# EAGLE design Minimum-System (EAGLE 6.0)
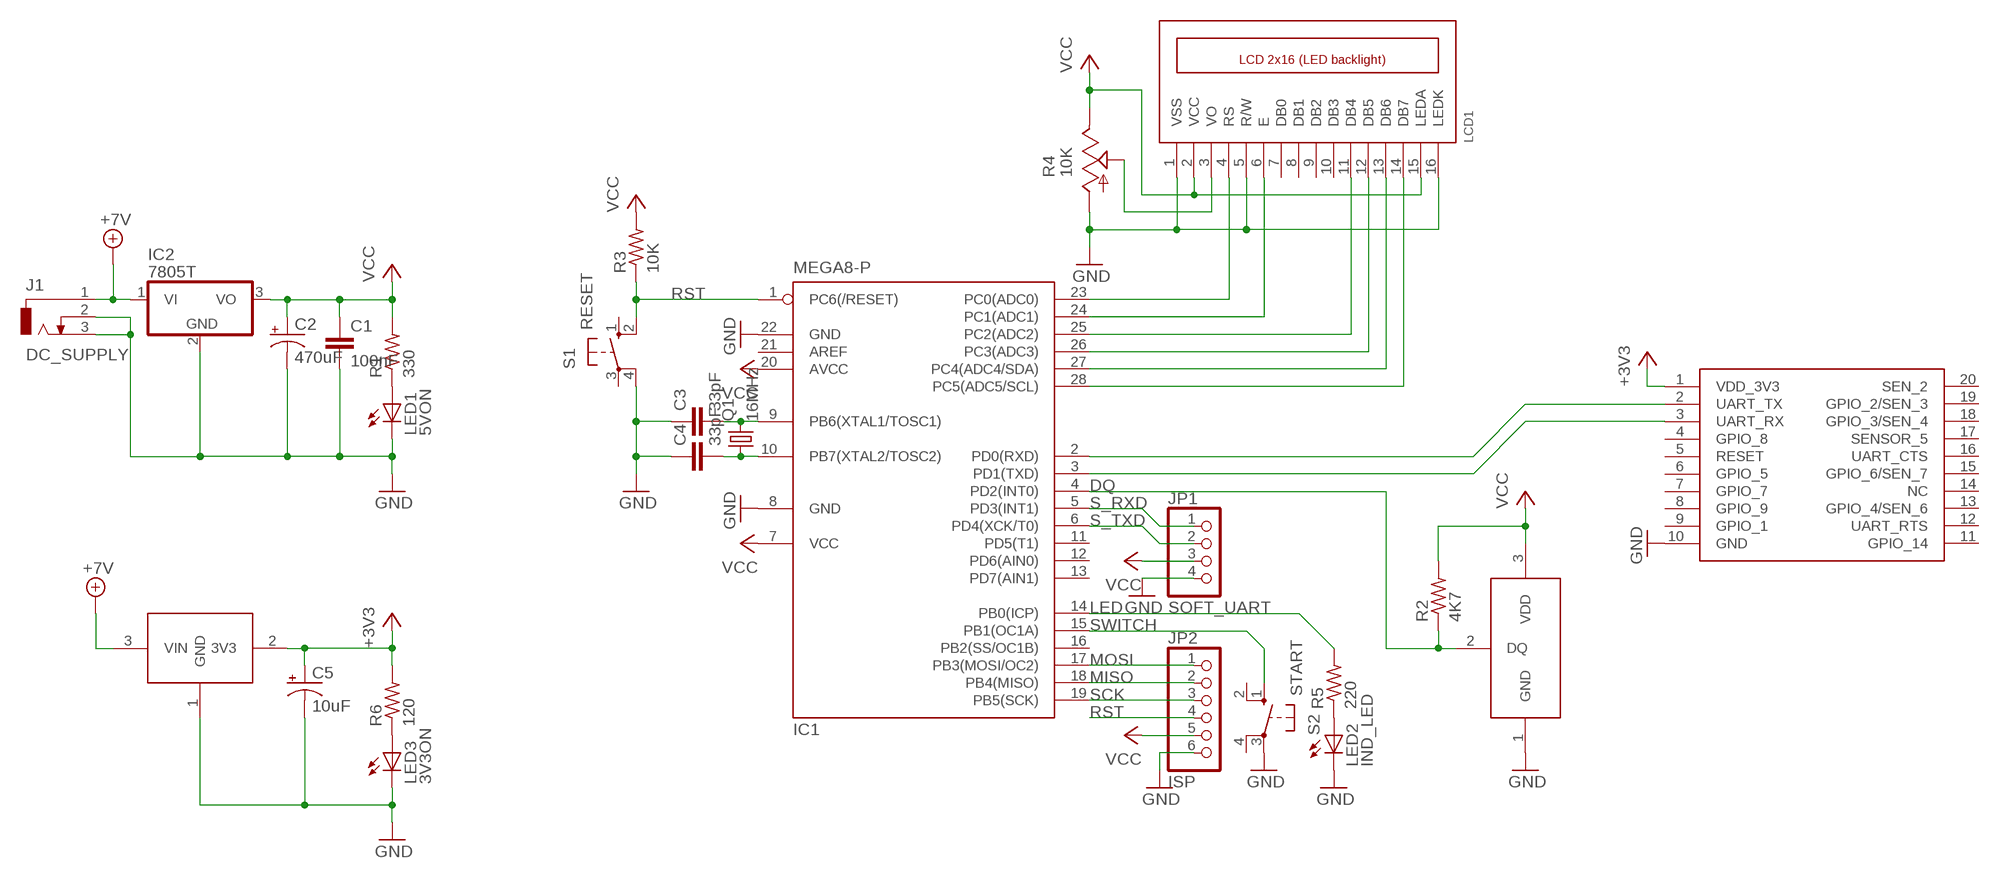
[diagram p0: schematic, sheet 1]

## Parts
C1  100nF  C-EU025-024X044  [C025-024X044]
C2  470uF  CPOL-USE2.5-7  [E2,5-7]
C3  33pF  C-EU025-024X044  [C025-024X044]
C4  33pF  C-EU025-024X044  [C025-024X044]
C5  10uF  CPOL-USE2.5-7  [E2,5-7]
IC1  MEGA8-P  [DIL28-3]
IC2  7805T  [TO220H]
J1  DC_SUPPLY  DCJ0202  [DCJ0202]
JP1  SOFT_UART  PINHD-1X4  [1X04]
JP2  ISP  PINHD-1X6  [1X06]
LCD1  LCD_2X16  LCD_2X16_SIL  [HY-1602F]
LED1  5VON  LED3MM  [LED3MM]
LED2  IND_LED  LED3MM  [LED3MM]
LED3  3V3ON  LED3MM  [LED3MM]
Q1  16MHz  CRYSTALHC49S  [HC49/S]
R1  330  R-US_0207/10  [0207/10]
R2  4K7  R-US_0207/10  [0207/10]
R3  10K  R-US_0207/10  [0207/10]
R4  10K  TRIM_US-CA6V  [CA6V]
R5  220  R-US_0207/10  [0207/10]
R6  120  R-US_0207/10  [0207/10]
S1  RESET  10-XX  [B3F-10XX]
S2  START  10-XX  [B3F-10XX]
U1  DS1820  [TO92]
U2  LD1117V33  [TO220]
U3  WIFLY  [WIFLY_SOCKET]

## Nets
+3V3: C5.+ R6.2 U2.2(3V3) U3.1(VDD_3V3)
+7V: IC2.1(VI) J1.1 U2.3(VIN)
DQ: IC1.4(PD2(INT0)) R2.1 U1.2(DQ)
GND: C1.2 C2.- C3.1 C4.1 C5.- IC1.8(GND) IC1.22(GND) IC2.2(GND) J1.2 J1.3 JP1.4 JP2.6 LCD1.1(VSS) LCD1.5(R/W) LCD1.16(LEDK) LED1.K(C) LED2.K(C) LED3.K(C) R4.A S1.4(P1) S2.3(P) U1.1(GND) U2.1(GND) U3.10(GND)
LED: IC1.14(PB0(ICP)) R5.2
MISO: IC1.18(PB4(MISO)) JP2.2
MOSI: IC1.17(PB3(MOSI/OC2)) JP2.1
N$1: LED1.A R1.1
N$2: IC1.25(PC2(ADC2)) LCD1.11(DB4)
N$3: LCD1.3(VO) R4.S
N$5: IC1.23(PC0(ADC0)) LCD1.4(RS)
N$6: C3.2 IC1.9(PB6(XTAL1/TOSC1)) Q1.2
N$7: C4.2 IC1.10(PB7(XTAL2/TOSC2)) Q1.1
N$8: IC1.24(PC1(ADC1)) LCD1.6(E)
N$9: IC1.26(PC3(ADC3)) LCD1.12(DB5)
N$10: IC1.27(PC4(ADC4/SDA)) LCD1.13(DB6)
N$11: IC1.28(PC5(ADC5/SCL)) LCD1.14(DB7)
N$12: IC1.2(PD0(RXD)) U3.2(UART_TX)
N$13: IC1.3(PD1(TXD)) U3.3(UART_RX)
N$14: LED2.A R5.1
N$16: LED3.A R6.1
RST: IC1.1(PC6(/RESET)) JP2.4 R3.1 S1.2(S1)
S_RXD: IC1.5(PD3(INT1)) JP1.1
S_TXD: IC1.6(PD4(XCK/T0)) JP1.2
SCK: IC1.19(PB5(SCK)) JP2.3
SWITCH: IC1.15(PB1(OC1A)) S2.1(S)
VCC: C1.1 C2.+ IC1.7(VCC) IC1.20(AVCC) IC2.3(VO) JP1.3 JP2.5 LCD1.2(VCC) LCD1.15(LEDA) R1.2 R2.2 R3.2 R4.E U1.3(VDD)
Unconnected: IC1.11(PD5(T1)) IC1.12(PD6(AIN0)) IC1.13(PD7(AIN1)) IC1.16(PB2(SS/OC1B)) IC1.21(AREF) LCD1.7(DB0) LCD1.8(DB1) LCD1.9(DB2) LCD1.10(DB3) S1.1(S) S1.3(P) S2.2(S1) S2.4(P1) U3.4(GPIO_8) U3.5(RESET) U3.6(GPIO_5) U3.7(GPIO_7) U3.8(GPIO_9) U3.9(GPIO_1) U3.11(GPIO_14) U3.12(UART_RTS) U3.13(GPIO_4/SEN_6) U3.14(NC) U3.15(GPIO_6/SEN_7) U3.16(UART_CTS) U3.17(SENSOR_5) U3.18(GPIO_3/SEN_4) U3.19(GPIO_2/SEN_3) U3.20(SEN_2)

## Library data of the parts
C1 C3 C4 = resistor:C-EU: CAPACITOR, European symbol
C2 C5 = resistor:CPOL-US: POLARIZED CAPACITOR, American symbol
IC1 = atmel:MEGA8-P: MICROCONTROLLER 8 Kbytes FLASH, 1 kbytes SRAM, 512 bytes EEPROM, USART, 4-channel 10 bit ADC, 2-channel 8 bit ADC Pin compatible with Atmega48, ATMega88, ATMega168 Source: avr.lbr; OC_FARNELL: unknown; OC_NEWARK: unknown
IC2 = linear:78*: Positive VOLTAGE REGULATOR Source: http://cache.national.com/ds/LM/LM78L05.pdf http://www.fairchildsemi.com/ds/LM/LM7805.pdf
J1 = con-jack:DCJ0202: DC POWER JACK Source: DCJ0202.pdf; OC_FARNELL: unknown; OC_NEWARK: unknown
JP1 = pinhead:PINHD-1X4: PIN HEADER
JP2 = pinhead:PINHD-1X6: PIN HEADER
LCD1 = lcd_2x16_led_backlight:LCD_2X16_SIL
LED1-LED3 = led:LED: LED OSRAM: - CHIPLED LG R971, LG N971, LY N971, LG Q971, LY Q971, LO R971, LY R971 LH N974, LH R974 LS Q976, LO Q976, LY Q976 LO Q996 - Hyper CHIPLED LW Q18S LB Q993, LB Q99A, LB R99A - SideLED LS A670, LO A670, LY A670, LG A670, LP A670 LB A673, LV A673, LT A673, LW A673 LH A674 LY A675 LS A676, LA A676, LO A676, LY A676, LW A676 LS A679, LY A679, LG A679 - Hyper Micro SIDELED® LS Y876, LA Y876, LO Y876, LY Y876 LT Y87S - SmartLED LW L88C, LW L88S LB L89C, LB L89S, LG L890 LS L89K, LO L89K, LY L89K LS L896, LA L896, LO L896, LY L896 - TOPLED LS T670, LO T670, LY T670, LG T670, LP T670 LSG T670, LSP T670, LSY T670, LOP T670, LYG T670 LG T671, LOG T671, LSG T671 LB T673, LV T673, LT T673, LW T673 LH T674 LS T676, LA T676, LO T676, LY T676, LB T676, LH T676, LSB T676, LW T676 LB T67C, LV T67C, LT T67C, LS T67K, LO T67K, LY T67K, LW E67C LS E67B, LA E67B, LO E67B, LY E67B, LB E67C, LV E67C, LT E67C LW T67C LS T679, LY T679, LG T679 LS T770, LO T770, LY T770, LG T770, LP T770 LB T773, LV T773, LT T773, LW T773 LH T774 LS E675, LA E675, LY E675, LS T675 LS T776, LA T776, LO T776, LY T776, LB T776 LHGB T686 LT T68C, LB T68C - Hyper Mini TOPLED® LB M676 - Mini TOPLED Santana® LG M470 LS M47K, LO M47K, LY M47K Source: http://www.osram.convergy.de LUXEON: - LUMILED® LXK2-PW12-R00, LXK2-PW12-S00, LXK2-PW14-U00, LXK2-PW14-V00 LXK2-PM12-R00, LXK2-PM12-S00, LXK2-PM14-U00 LXK2-PE12-Q00, LXK2-PE12-R00, LXK2-PE12-S00, LXK2-PE14-T00, LXK2-PE14-U00 LXK2-PB12-K00, LXK2-PB12-L00, LXK2-PB12-M00, LXK2-PB14-N00, LXK2-PB14-P00, LXK2-PB14-Q00 LXK2-PR12-L00, LXK2-PR12-M00, LXK2-PR14-Q00, LXK2-PR14-R00 LXK2-PD12-Q00, LXK2-PD12-R00, LXK2-PD12-S00 LXK2-PH12-R00, LXK2-PH12-S00 LXK2-PL12-P00, LXK2-PL12-Q00, LXK2-PL12-R00 Source: www.luxeon.com KINGBRIGHT: KA-3528ASYC Source: www.kingbright.com
Q1 = crystal:CRYSTAL: CRYSTAL; OC_FARNELL: 1667008; OC_NEWARK: unknown
R1-R3 R5 R6 = resistor:R-US_: RESISTOR, American symbol
R4 = pot:TRIM_US-: POTENTIOMETER
S1 S2 = switch-omron:10-XX: OMRON SWITCH; MPN: B3F-1000; OC_FARNELL: 176432; OC_NEWARK: 36M3542
U1 = DS1820:DS1820
U2 = LD1117V33:LD1117V33
U3 = RN-VX Wifly:WIFLY

## Board
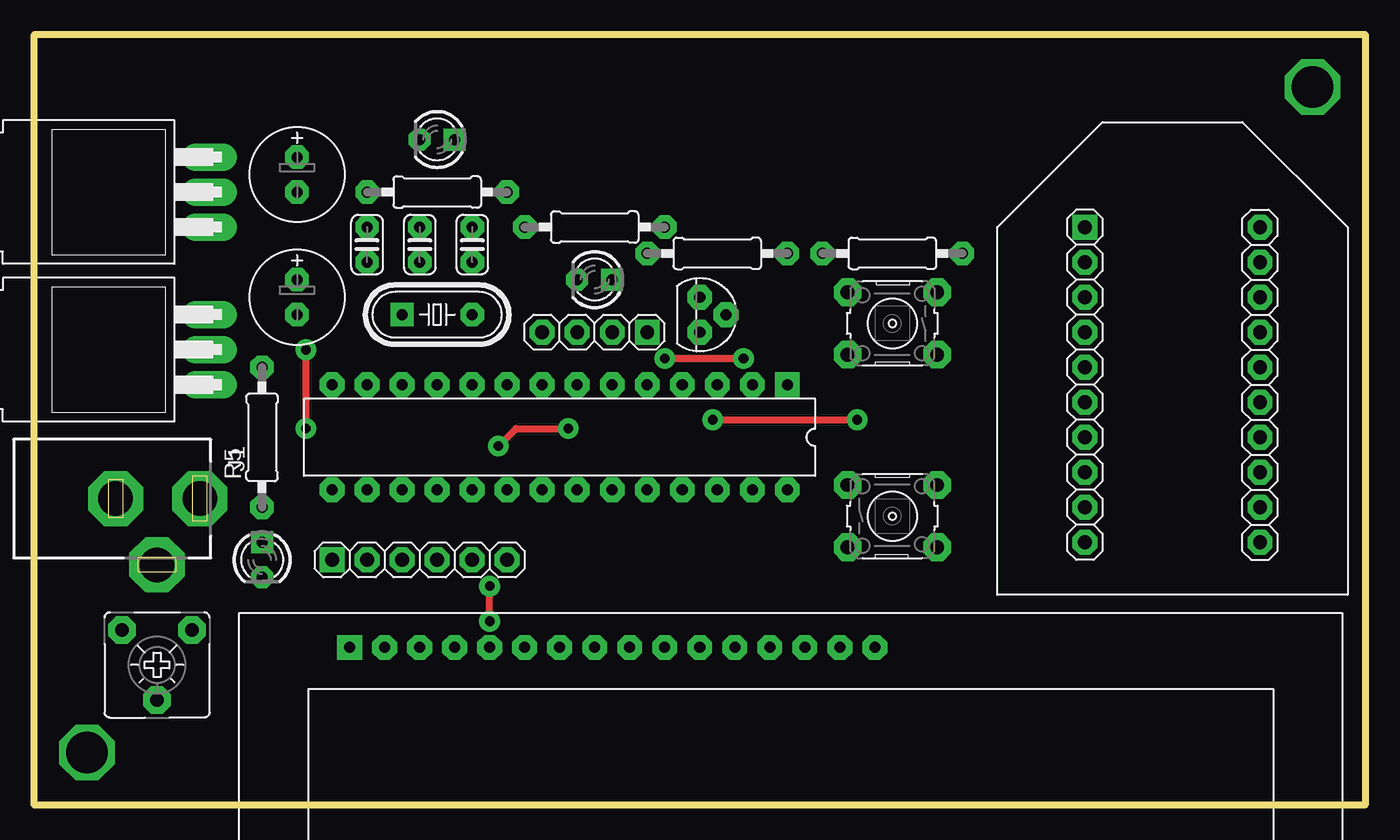
[diagram p1: board, top side]
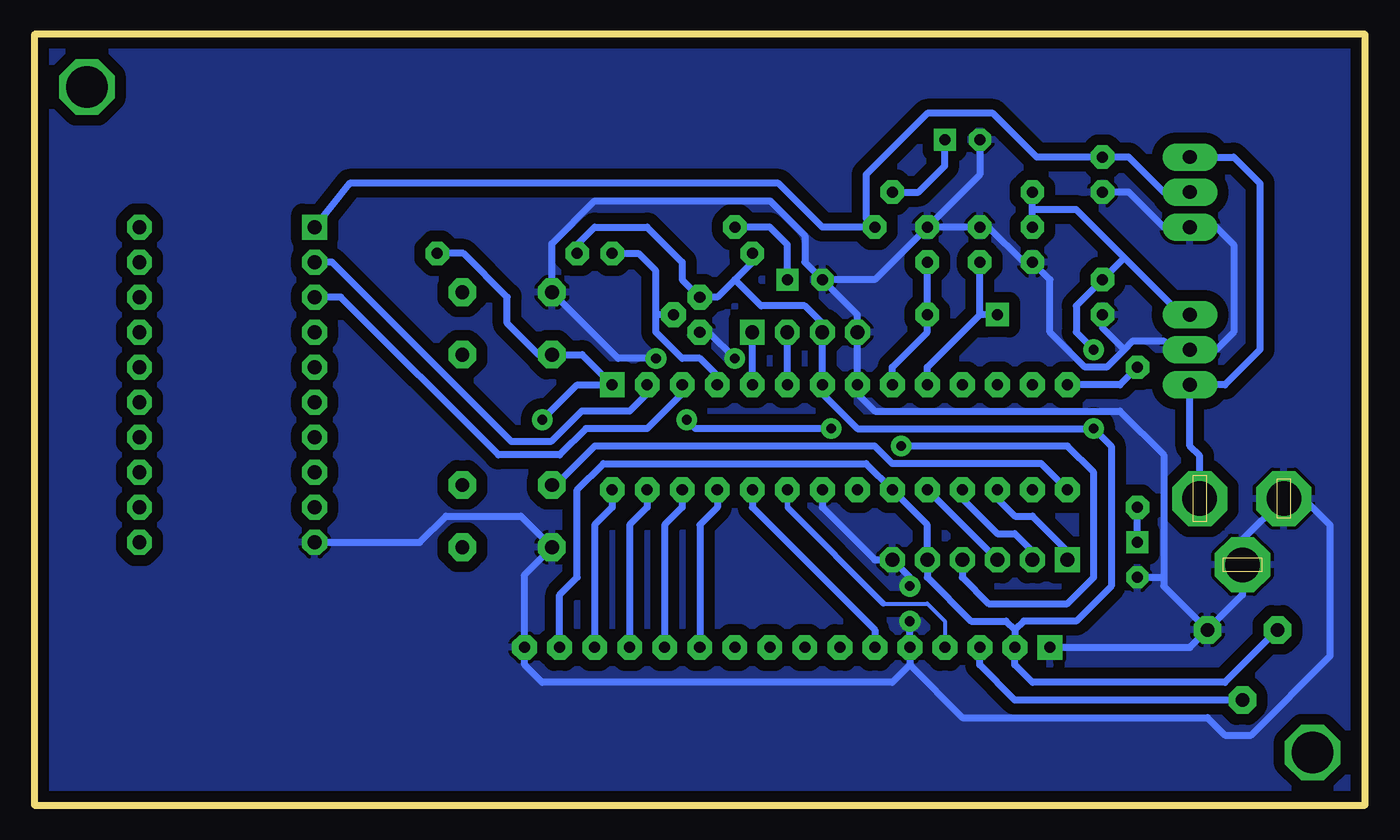
[diagram p2: board, bottom side, seen from below]

Size 96.52 x 55.88 mm. Coordinates in mm from the lower left corner, seen from the top.
Outline: 0,55.88 96.52,55.88 96.52,0 0,0 0,55.88
Copper layers (1*16): Top 0.035mm / dielectric 1.5mm / Bottom 0.035mm
Design rules: minimum track width 0.2mm, minimum drill 0.5mm, track to track 0.2mm, track to pad 0.2mm, pad to pad 8mil, via to via 8mil, smd to smd 8mil, copper to edge 10mil, drill to drill 8mil, minimum pad ring 12mil, minimum via ring 10mil, stop-mask expansion 4mil, vias tented up to drill 25mil, thermal gap 10mil

### Footprints (pad centres in the part's own frame; a part is rotated, then mirrored left to right if it is on the bottom)
C025-024X044 = drill 0.8 pad 1.7 octagon: 1 -1.27,0; 2 1.27,0
E2,5-7 = drill 0.8 pad 1.7 octagon: + -1.27,0; - 1.27,0
DIL28-3 = drill 0.8 pad 1.8 square: 1 -16.51,-3.81 | drill 0.8 pad 1.8 octagon: 2 -13.97,-3.81; 3 -11.43,-3.81; 4 -8.89,-3.81; 5 -6.35,-3.81; 6 -3.81,-3.81; 7 -1.27,-3.81; 8 1.27,-3.81; 9 3.81,-3.81; 10 6.35,-3.81; 11 8.89,-3.81; 12 11.43,-3.81; 13 13.97,-3.81; 14 16.51,-3.81; 15 16.51,3.81; 16 13.97,3.81; 17 11.43,3.81; 18 8.89,3.81; 19 6.35,3.81; 20 3.81,3.81; 21 1.27,3.81; 22 -1.27,3.81; 23 -3.81,3.81; 24 -6.35,3.81; 25 -8.89,3.81; 26 -11.43,3.81; 27 -13.97,3.81; 28 -16.51,3.81
TO220H = drill 1 pad 2 long: 1 -2.54,-10.16; 2 0,-10.16; 3 2.54,-10.16
DCJ0202 = drill 2.5 pad 4 octagon: 1 0,3.1; 2 4.8,0; 3 0,-3
1X04 = drill 1 pad 1.8 square: 1 -3.81,0 | drill 1 pad 1.8 octagon: 2 -1.27,0; 3 1.27,0; 4 3.81,0
1X06 = drill 1 pad 1.8 square: 1 -6.35,0 | drill 1 pad 1.8 octagon: 2 -3.81,0; 3 -1.27,0; 4 1.27,0; 5 3.81,0; 6 6.35,0
HY-1602F = drill 0.8 pad 1.8 square: 1 2.54,0 | drill 0.8 pad 1.8 octagon: 2 5.08,0; 3 7.62,0; 4 10.16,0; 5 12.7,0; 6 15.24,0; 7 17.78,0; 8 20.32,0; 9 22.86,0; 10 25.4,0; 11 27.94,0; 12 30.48,0; 13 33.02,0; 14 35.56,0; 15 38.1,0; 16 40.64,0
LED3MM = drill 0.8 pad 1.6 square: A -1.27,0 | drill 0.8 pad 1.6 octagon: K 1.27,0
HC49/S = drill 0.8 pad 1.7 square: 1 -2.54,0 | drill 0.8 pad 1.7 octagon: 2 2.54,0
0207/10 = drill 0.8 pad 1.7 octagon: 1 -5.08,0; 2 5.08,0
CA6V = drill 1 pad 2 octagon: A -2.54,-2.54; E 2.54,-2.54; S 0,2.54
B3F-10XX = drill 1 pad 2 octagon: 1 -3.251,2.261; 2 3.251,2.261; 3 -3.251,-2.261; 4 3.251,-2.261
TO92 = drill 0.8 pad 1.8 octagon: 1 1.27,0; 2 0,1.905; 3 -1.27,0
TO220 = drill 1 pad 2 long: 1 -2.54,-8.89; 2 0,-8.89; 3 2.54,-8.89
WIFLY_SOCKET = drill 1 pad 1.8 square: 1 -11.43,-6.35 | drill 1 pad 1.8 octagon: 2 -8.89,-6.35; 3 -6.35,-6.35; 4 -3.81,-6.35; 5 -1.27,-6.35; 6 1.27,-6.35; 7 3.81,-6.35; 8 6.35,-6.35; 9 8.89,-6.35; 10 11.43,-6.35; 11 11.43,6.35; 12 8.89,6.35; 13 6.35,6.35; 14 3.81,6.35; 15 1.27,6.35; 16 -1.27,6.35; 17 -3.81,6.35; 18 -6.35,6.35; 19 -8.89,6.35; 20 -11.43,6.35

### Placement (x,y rotation side)
C1  24.13,40.64 270 top
C2  19.05,36.83 270 top
C3  31.75,40.64 270 top
C4  27.94,40.64 270 top
C5  19.05,45.72 270 top
IC1  38.1,26.67 180 top
IC2  2.54,33.02 90 top
J1  8.89,22.23 270 top
JP1  40.64,34.29 180 top
JP2  27.94,17.78 0 top
LCD1  20.32,11.43 0 top
LED1  29.21,48.26 180 top
LED2  16.51,17.78 270 top
LED3  40.64,38.1 180 top
Q1  29.21,35.56 0 top
R1  29.21,44.45 180 top
R2  49.53,40.01 180 top
R3  62.23,40.01 180 top
R4  8.89,10.16 180 top
R5  16.51,26.67 90 top
R6  40.64,41.91 180 top
S1  62.23,34.92 180 top
S2  62.23,20.95 0 top
U1  48.26,35.56 270 top
U2  3.81,44.45 90 top
U3  82.55,30.48 270 top

### Tracks (layer width: path | path; a pad name or v marks a point on that pad's centre or on a via)
+3V3
  Bottom 0.5: U2.2 14.61,44.45 17.14,46.99 C5.+ 23.81,46.99 26.99,50.16 31.75,50.16 36.2,45.72 36.2,42.55 R6.2 39.37,41.91 42.55,45.09 73.66,45.09 U3.1
+7V
  Bottom 0.5: J1.1 11.99,25.33 12.7,26.03 IC2.1 10.16,30.48 7.62,33.02 7.62,45.09 9.53,46.99 U2.3
DQ
  Bottom 0.5: IC1.4 46.99,31.12 48.26,32.38 49.53,32.38 51.44,34.29 51.44,35.56 | R2.1 52.71,40.01 51.44,38.73 51.44,35.56 | U1.2 51.44,35.56
GND  (via drill 0.7 pad 1.5)
  Top 0.5: v45.72,32.38 v51.44,32.38 | v33.02,13.34 v33.02,15.88
  Bottom 0.5: IC1.22 39.37,21.59 35.56,17.78 JP2.6 33.02,16.51 v33.02,15.88 | 33.02,10.16 29.21,6.35 11.43,6.35 10.16,5.08 8.26,5.08 2.54,10.79 2.54,20.32 4.45,22.23 J1.3 8.89,19.23 J1.2 8.89,15.24 R4.A | U3.10 68.58,19.05 66.67,20.95 61.24,20.95 S2.3 60.96,16.71 LCD1.16 60.96,10.16 59.69,8.89 34.29,8.89 33.02,10.16 | C5.- 17.14,44.45 14.61,41.91 U2.1 10.79,41.91 9.53,40.64 9.53,34.29 10.79,33.02 IC2.2 13.97,33.02 14.61,33.66 16.83,33.66 17.46,33.02 | C3.1 C4.1 27.3,41.91 24.77,39.37 C1.2 22.86,38.1 22.86,34.29 20.32,31.75 18.73,31.75 17.46,33.02 | LED1.K 27.94,45.72 C3.1 | LED3.K 36.83,35.56 JP1.4 IC1.8 36.83,29.84 35.56,28.58 17.78,28.58 14.61,25.4 14.61,16.51 | C3.1 35.56,38.1 LED3.K | 33.02,10.16 LCD1.5 v33.02,13.34 | LED3.K 40.64,39.37 40.64,41.27 43.18,43.82 55.88,43.82 58.98,40.72 S1.4 54.18,32.38 v51.44,32.38 | U1.1 47.62,34.29 v45.72,32.38 | C2.- 19.05,34.61 17.46,33.02 | 14.61,16.51 14.61,15.88 R4.A | LED2.K 14.61,16.51 | LCD1.1 12.7,11.43 R4.A
  pour Bottom (isolate 0.8): 0,0 96.52,0 96.52,55.88 0,55.88
LED
  Bottom 0.5: R5.2 17.78,30.48 IC1.14
MISO
  Bottom 0.5: IC1.18 29.21,22.23 26.67,19.69 25.4,19.69 24.13,18.41 JP2.2
MOSI
  Bottom 0.5: IC1.17 26.67,22.23 25.4,20.95 24.13,20.95 21.59,18.41 JP2.1
N$1
  Bottom 0.5: R1.1 32.38,44.45 30.48,46.36 LED1.A
N$2
  Bottom 0.5: IC1.25 46.99,21.59 48.26,20.32 LCD1.11
N$3
  Bottom 0.5: R4.S 25.4,7.62 27.94,10.16 LCD1.3
N$4
  pour Bottom (isolate 0.8): 0,0 96.52,0 96.52,55.88 0,55.88
N$5
  Bottom 0.3: 34.93,14.61 31.75,14.61 30.48,13.34 LCD1.4
  Bottom 0.4: IC1.23 41.91,21.59 34.93,14.61
N$6
  Bottom 0.5: IC1.9 34.29,31.75 31.75,34.29 Q1.2 C3.2
N$7
  Bottom 0.5: IC1.10 31.75,31.75 27.94,35.56 | 27.94,35.56 C4.2 | Q1.1 27.94,35.56
N$8
  Bottom 0.5: IC1.24 44.45,21.59 35.56,12.7 LCD1.6
N$9
  Bottom 0.5: IC1.26 49.53,21.59 50.8,20.32 LCD1.12
N$10
  Bottom 0.5: IC1.27 52.07,21.59 53.34,20.32 LCD1.13
N$11
  Bottom 0.5: IC1.28 54.61,21.59 55.88,20.32 LCD1.14
N$12
  Bottom 0.5: IC1.2 52.07,29.84 53.34,28.58 56.83,28.58 59.05,26.35 61.91,26.35 74.93,39.37 U3.2
N$13
  Bottom 0.5: IC1.3 49.53,29.84 52.07,27.3 56.52,27.3 58.42,25.4 62.87,25.4 74.3,36.83 U3.3
N$14
  Bottom 0.5: LED2.A R5.1
N$15  (via drill 3)
  other vias: 92.71,52.07
N$16
  Bottom 0.5: LED3.A 41.91,40.64 43.18,41.91 R6.1
N$17  (via drill 3)
  other vias: 3.81,3.81
RST  (via drill 0.7 pad 1.5)
  Top 0.5: v33.66,26.03 34.93,27.3 v38.74,27.3 | v49.21,27.94 v59.69,27.94
  Bottom 0.5: R3.1 65.41,40.01 62.23,36.83 62.23,34.92 59.97,32.66 S1.2 56.79,32.66 IC1.1 57.15,30.48 v59.69,27.94 | JP2.4 29.21,16.51 27.3,14.61 21.59,14.61 19.68,16.51 19.68,24.13 21.59,26.03 v33.66,26.03 | v49.21,27.94 48.58,27.3 v38.74,27.3
S_RXD
  Bottom 0.5: IC1.5 JP1.1
S_TXD
  Bottom 0.5: IC1.6 JP1.2
SCK
  Bottom 0.5: IC1.19 JP2.3
SWITCH
  Bottom 0.5: S2.1 58.7,23.22 55.88,26.03 35.56,26.03 34.29,24.77 23.5,24.77 IC1.15
VCC  (via drill 0.7 pad 1.5)
  Top 0.5: v19.68,33.02 v19.68,27.3
  Bottom 0.5: 25.4,12.7 26.04,13.34 28.57,13.34 31.75,16.51 JP2.5 31.75,20.32 IC1.20 36.2,24.77 55.25,24.77 57.15,22.86 57.15,16.51 58.42,15.24 LCD1.15 | 25.4,12.7 LCD1.2 25.4,10.16 24.13,8.89 10.16,8.89 R4.E | R2.2 44.45,39.37 45.72,38.1 | 45.72,38.1 46.99,36.83 U1.3 49.53,38.1 49.53,39.37 52.07,41.91 55.88,41.91 57.15,40.64 R3.2 | 45.72,38.1 43.82,36.2 40.64,36.2 39.37,34.92 JP1.3 IC1.7 39.37,29.84 36.83,27.3 v19.68,27.3 18.41,26.03 18.41,15.88 20.95,13.34 24.77,13.34 25.4,12.7 | IC2.3 13.33,35.56 17.46,39.69 | 17.46,39.69 20.95,43.18 24.13,43.18 | 24.13,43.18 R1.2 | C1.1 24.13,43.18 | 17.46,39.69 C2.+ 20.95,36.2 20.95,34.29 v19.68,33.02